# Altium schematic sheet Servo_Tester.SchDoc
size A4; SheetNumber: 1; SheetTotal: 1
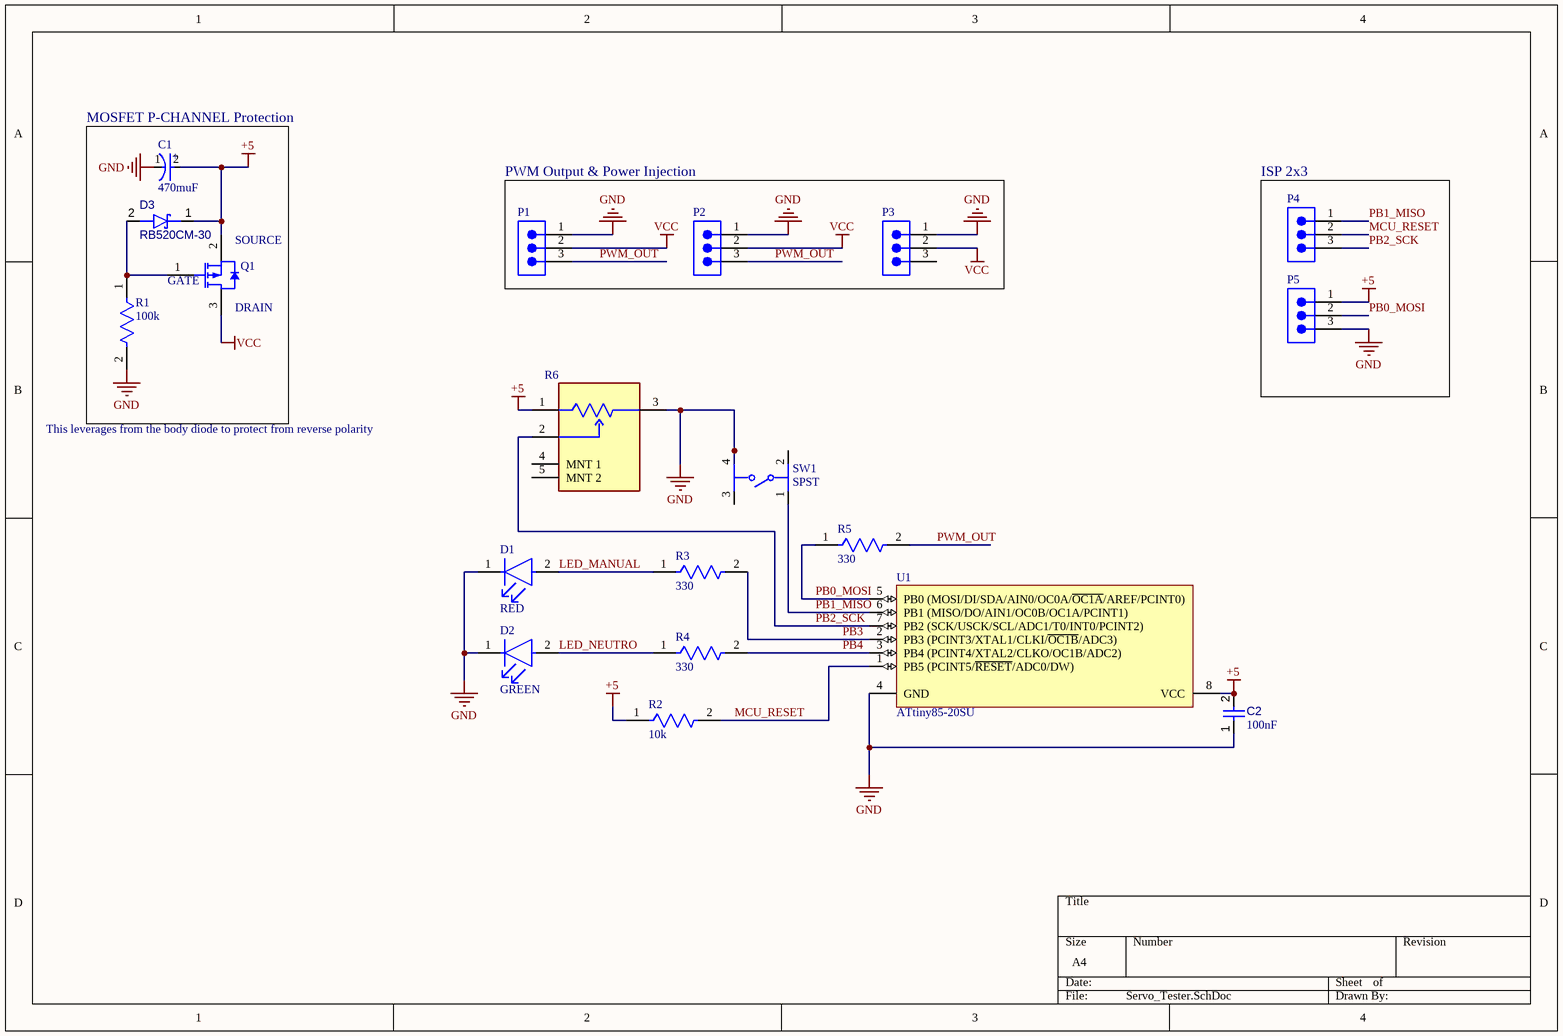
[diagram p0: Servo_Tester.SchDoc]

## Parts
C1  470muF  [FP-RAD-TH-D_10_0_5-L_12_5-MFG]
C2  value 100nF  [CAPC1608X90X40NL10T20]  (hidden comment: Capacitor 100 nF +/-10% 50 V 0603)
D1  RED  [FP-LTST-C191KRKT-MFG]
D2  GREEN  [FP-LTST-C191KGKT-MFG]
D3  RB520CM-30  [ROHM-VMN2-2_V]
P1  TSW-103-07-F-S  [SMTC-TSW-103-07-X-S]  (value not drawn)
P2  TSW-103-07-F-S  [SMTC-TSW-103-07-X-S]  (value not drawn)
P3  TSW-103-07-F-S  [SMTC-TSW-103-07-X-S]  (value not drawn)
P4  TSW-103-07-F-S  [SMTC-TSW-103-07-X-S]  (value not drawn)
P5  TSW-103-07-F-S  [SMTC-TSW-103-07-X-S]  (value not drawn)
Q1  AO3401A  [AO-SOT-23-3L_V]  (value not drawn)
R1  100k  [FP-RC0603-0_55-MFG]
R2  10k  [FP-RC0603-0_55-IPC_C]
R3  330  [FP-RK73H2A-IPC_B]
R4  330  [FP-RK73H2A-IPC_B]
R5  330  [FP-RK73H2A-IPC_B]
R6  10k  [FP-RK09L1140A2U-MFG]  (value not drawn)
SW1  SPST  [FP-1-1977223-9-MFG]
U1  ATtiny85-20SU  [8S2_M]

## Blocks framed on the sheet
MOSFET P-CHANNEL Protection: C1 D3 Q1 R1
PWM Output & Power Injection: P1-P3
ISP 2x3: P4 P5

## Nets
+5: C1.2(A) C2.2 D3.1(K) P5.1 Q1.2(SOURCE) R2.1 R6.1 U1.8(VCC)
GND: C1.1(C) C2.1 D1.1(C) D2.1(C) P1.1 P2.1 P3.1 P5.3 R1.2 R6.3 SW1.4 U1.4(GND)
VCC: P1.2 P2.2 P3.2 Q1.3(DRAIN)
LED_MANUAL: D1.2(A) R3.1
LED_NEUTRO: D2.2(A) R4.1
MCU_RESET: P4.2 R2.2 U1.1(PB5_(PCINT5/~{RESET}/ADC0/DW))
PB0_MOSI: P5.2 R5.1 U1.5(PB0_(MOSI/DI/SDA/AIN0/OC0A/~{OC1A}/AREF/PCINT0))
PB1_MISO: P4.1 SW1.1 U1.6(PB1_(MISO/DO/AIN1/OC0B/OC1A/PCINT1))
PB2_SCK: P4.3 R6.2 U1.7(PB2_(SCK/USCK/SCL/ADC1/T0/INT0/PCINT2))
PB3: R3.2 U1.2(PB3_(PCINT3/XTAL1/CLKI/~{OC1B}/ADC3))
PB4: R4.2 U1.3(PB4_(PCINT4/XTAL2/CLKO/OC1B/ADC2))
PWM_OUT: P1.3 P2.3 R5.2
NetD3_2: D3.2(A) Q1.1(GATE) R1.1

Not connected (* = marked no-connect by the designer): P3 3; R6 4(MNT_1) 5(MNT_2); SW1 2 3

## Notes on the sheet
- (near Q1) SOURCE
- (near Q1) GATE
- (near Q1) DRAIN
- This leverages from the body diode to protect from reverse polarity
- (in symbol CMP-05427-001980-1) +

## Library data of the parts
C1 = CMP-05427-001980-1: Aluminum Electrolytic Capacitors (Radial Lead Type) 470uF ±20% 16V; Ripple Current: 1.29A; ESR (Equivalent Series Resistance): 38mR; Life (Hours): 4000Hour; Lead Diameter: 0.6mm; Height: 12.5mm; Package Quantity: 500; Lead Free: Lead Free; Voltage Rating: 16V; Diameter: 10mm; Radiation Hardening: No; Packaging: Tape and Reel; Case/Package: Radial; Tolerance: 20%; Series: FM; Capacitance: 470uF; Height - Seated (Max): 0.551inch; Max Operating Temperature: 105°C; Termination: Radial; Mount: Through Hole; RoHS Compliant: Yes; Voltage Rating (DC): 16V; Impedance: 38mR; Length: 12.5mm; Lead Pitch: 5mm; Min Operating Temperature: -40°C
C2 = CMP-001-00017-6: Chip Capacitor, 100 nF, +/- 10%, 50 V, 0603 (1608 Metric); Voltage Rating: 50V; Capacitor Type: Ceramic; Tolerance: 10%; Mounting Technology: SM; Max Operating Temperature: 125°C; RoHS Compliant: True; Pins: 2; Case/Package: 0603; Min Operating Temperature: -55°C
D1 = CMP-2000-05199-2: NexarPartId: 549908; Lens Transparency: Clear; Luminous Intensity: 54mcd; Current: 2A; Forward Current: 20mA; Number of Elements: 1; Power Rating: 75mW; Lens Color: Colorless; Wavelength: 639nm; Viewing Angle: 130°; Voltage: 2V; Dominant Wavelength: 631nm; Reverse Voltage: 5V; Illumination Color: Red; Height: 550µm; Length: 1.6mm; Number of Pins: 2; Packaging: Tape and Reel; Mount: Surface Mount; Case Code (Metric): 1608; Radiation Hardening: No; Case Code (Imperial): 0603; Test Current: 20mA; Number of LEDs: 1; Schedule B: 8541402000, 8541402000; Lead Free: Lead Free; Power Dissipation: 75mW; RoHS: Compliant; Forward Voltage: 2V; Lens Style: Clear; Color: Red; Max Operating Temperature: 85°C; Depth: 800µm; Width: 800µm; Min Operating Temperature: -55°C; Case/Package: 0603
D2 = CMP-2000-05198-4: NexarPartId: 549907; Forward Voltage: 2V; Viewing Angle: 130°; Lens Transparency: Clear; Power Rating: 75mW; Number of LEDs: 1; Luminous Intensity: 35mcd; Forward Current: 20mA; Dominant Wavelength: 571nm; Lens Color: Clear, Colorless; Reverse Voltage: 5V; Wavelength: 574nm; Number of Pins: 2; Packaging: Tape and Reel; Number of Elements: 1; Schedule B: 8541402000, 8541402000; Height: 550µm; Case/Package: 0603; Illumination Color: Green; Depth: 800µm; Max Operating Temperature: 85°C; RoHS: Compliant; Lens Style: Clear; Lead Free: Lead Free; Length: 1.6mm; Mount: Surface Mount; Test Current: 20mA; Width: 800µm; Case Code (Imperial): 0603; Min Operating Temperature: -55°C; Case Code (Metric): 1608; Radiation Hardening: No; Power Dissipation: 75mW; Color: Green
D3 = CMP-004-00028-3: DIODE SCHOTTKY 30V 100MA VMN2M; Case/Package: SMD/SMT; Pins: 2; Mounting Technology: SMT
P1-P5 = CMP-1024-00331-1: 0.025" SQ Post Header, Through-hole, Vertical, -55 to 125 degC, 2.54 mm Pitch, 3-Pin, Male, RoHS; Manufacturer: Samtec; Pitch: 2.54 mm; DatasheetVersion: F-214; ComponentLink1Description: Manufacturer URL; ComponentLink3URL: http://www.samtec.com/documents/webfiles/cpdf/TSW-XXX-XX-XXX-X-XX-XXX-MKT.pdf; Mounting Technology: Through-hole; PackageDescription: .025[0.64] SQ. Post Terminal Strip Assembly; Temperature Range: -55 to 125 degC; ComponentLink3Description: Package Specification; Orientation: Vertical; PartNumber: TSW-103-07-F-S; RoHS: True; PackageVersion: DM, 8/1988; ComponentLink2Description: Datasheet; ComponentLink1URL: http://www.samtec.com; ComponentLink2URL: http://www.samtec.com/documents/webfiles/pdf/TSW_TH.PDF; PackageReference: TSW-103-07-X-S
Q1 = CMP-2000-05778-1: P-Channel MOSFET, 30 V, 4 A, -55 to 150 degC, 3-Pin SOT-23-3L, RoHS, Tape and Reel; Manufacturer: Alpha and Omega; Output Power (Max): NotRequiredW; Power Dissipation: 1.4W; Rad Hardened: No; Drain Efficiency: NotRequired%; Drain-Source On-Volt: 30V; Noise Figure: NotRequireddB; Frequency (Max): NotRequiredMHz; Number of  Elements: 1; Gate-Source Voltage (Max): ?12V; Drain Current (Max): 4A; Channel Mode: Enhancement; Drain-Source On-Res: 0.044ohm; Type: PowerMOSFET; Polarity: P; Package URL: http://www.aosmd.com/res/packaging_information/SOT-23-3L.pdf; Datasheet URL: http://www.aosmd.com/res/data_sheets/AO3401A.pdf; Package Type: SOT-23; Package Description: 3-Pin Small Outline Transistor, Body 2.95 x 1.6 mm, Pitch 0.95 mm; Mounting: SurfaceMount; Manufacturer URL: http://www.aosmd.com/; Continuous Drain Current: 4A; Package Reference: SOT-23-3L; Mounting Technology: SurfaceMount; Operating Temperature Classification: Military; Power Gain: NotRequireddB; Datasheet Version: Rev. 3, 03/2011; Operating Temp Range: -55Cto150C; Pin Count: 3
R1 = CMP-2100-03662-2: RES SMD 100K OHM 1% 1/10W 0603; Voltage Rating (DC): 50V; Resistance: 100kR; Max Power Dissipation: 100mW; Temperature Coefficient: 100ppm/°C; Working Voltage: 75V; Length: 1.6mm; Lead Free: Lead Free; Number of Terminations: 2; Packaging: Tape and Reel; Voltage Rating: 50V; Termination: SMD/SMT; Width: 0.8mm; Resistor Type: Thick Film; Resistance Tolerance: 1%; Features: Moisture Resistant; Height: 0.45mm; Construction: Rectangular; Case/Package: 0603; Military Standard: Not; Case Code (Imperial): 0603; Series: RC; Technology: THICK FILM; Depth: 0.8mm; RoHS Compliant: Yes; REACH SVHC: No SVHC; Min Operating Temperature: -55°C; Case Code (Metric): 1608; Max Operating Temperature: 155°C; Power Rating: 100mW; Number of Pins: 2; Tolerance: 1%
R2 = CMP-2100-03664-2: RES 10K OHM 1% 1/10W 0603; Voltage Rating: 75V; Voltage Rating (DC): 50V; Resistance: 10kR; Power Rating: 100mW; Temperature Coefficient: 100ppm/°C; Depth: 0.8mm; Termination: SMD/SMT; Resistor Type: Thick Film; Series: RC; Construction: Rectangular; Features: Moisture Resistant; Packaging: Tape and Reel; Min Operating Temperature: -55°C; Number of Terminations: 2; Lead Pitch: 0.3mm; RoHS Compliant: Yes; Case/Package: 0603; Resistance Tolerance: 1%; Military Standard: Not; Weight: 7.1E-05oz; Number of Pins: 2; Tolerance: 1%; Length: 1.6mm; Case Code (Imperial): 0603; Lead Free: Lead Free; Width: 0.8mm; Max Power Dissipation: 100mW; Height: 0.45mm; Max Operating Temperature: 155°C; Case Code (Metric): 1608; Size Code: 0603
R3-R5 = CMP-04015-086888-1: 330Ω ±1% 0.25W Chip Resistor 0805 Thick Film AEC-Q200 Qualified; Temperature Coefficient: 100ppm/°C; Resistance: 330R; Voltage Rating: 150V; Power Rating: 125mW; Series: RK73H; Min Operating Temperature: -55°C; Case Code (Metric): 2012; Max Operating Temperature: 155°C; Tolerance: 1%; Termination: SMD/SMT; Packaging: Tape and Reel; Lead Free: Lead Free; Case Code (Imperial): 0805; RoHS Compliant: Yes; Case/Package: 0805
R6 = CMP-24118-000002-1: 9mm Size Metal Shaft Snap-in Type RK09L Series; Manufacturer Part Number: RK09L1140A2U; Manufacturer: ALPS; Tolerance: 20%; Resistance: 10kΩ; Standoff Height: 2.55mm; Value: 10kΩ; Power Rating: 0.05W; Voltage Rating: 50V; Lead Free: Yes; Temperature: -10°C to +70°C; Device Class L1: Passive Components; ComponentLink2Description: Datasheet; Octopart: https://octopart.com/rk09l1140a2u-alps-7850070; Device Class L2: Resistors; Package: RK09L1140A2U; Height: 30mm; Category: Res; Temperature Range High: +70°C; Temperature Range Low: -10°C; RoHS: TRUE; Series: RK09L; Automotive: No; ComponentLink2URL: https://www.alps.com/prod/info/E/HTML/Potentiometer/RotaryPotentiometers/RK09L/RK09L1140A2U.html; Device Class L3: Variable Resistors and Potentiometers
SW1 = CMP-03407-000015-1: SWITCH TACTILE SPST-NO 0.05A 24V; Current Rating: 50mA; Operating Force: 2.55N; Actuator Material: Nylon; Actuator Color: Pink; Mechanical Life: 1000000Cycles; Illumination Type: Non-Illuminated; Switch Travel: 0.25mm; Switch Function: Off-Mom; Actuator Type: Standard; RoHS Compliant: Yes; Min Operating Temperature: -40°C; Contact Plating: Silver; Max Operating Temperature: 105°C; Contact Material: Stainless Steel; Max Current Rating: 50mA; Series: FSMJSMA; Throw Configuration: SPST; Length: 6mm; Radiation Hardening: No; Depth: 10mm; Max Voltage Rating (DC): 24V; Orientation: Straight; Termination: Gull Wing; Voltage Rating (DC): 24V; Packaging: Bulk; Mount: Surface Mount; Case/Package: SMD/SMT; Package Quantity: 750
U1 = CMP-0093-00173-2: 8-bit AVR Microcontroller, 20MHz, 2.7-5.5V, 8K Flash, 512 Bytes EEPROM, 512 Bytes SRAM, Industrial Grade (-40°C to 85°C), 8-Lead SOIC, Pb-Free; ComponentLink3Description: ATtiny25/45/85 Summary; DatasheetVersion: revN, Apr-2011; PackageVersion: revF, Apr-2008; ComponentLink3URL: http://www.atmel.com/dyn/resources/prod_documents/2586S.pdf; ComponentLink1URL: http://www.atmel.com/; ComponentLink2Description: ATtiny25/45/85 Datasheet; RevisionNote: DatasheetVersion updated. URLs added.; PackageDescription: 8-Lead, 0.208" Body, Plastic Small Outline Package (EIAJ); ComponentLink1Description: Manufacturer URL; PackageReference: 8S2; ComponentLink2URL: http://www.atmel.com/dyn/resources/prod_documents/doc2586.pdf